# EAGLE design Laser785Adapter (EAGLE 8.0.2)
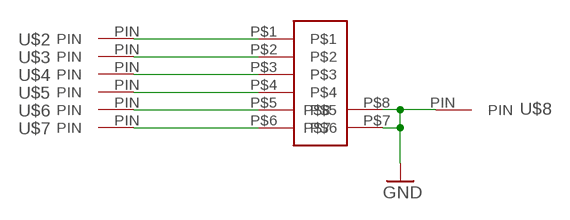
[diagram p0: schematic, sheet 1]

## Parts
U$1  MOLEX_5023860670  [MOLEX_5023860670]
U$2  PIN  [PIN]
U$3  PIN  [PIN]
U$4  PIN  [PIN]
U$5  PIN  [PIN]
U$6  PIN  [PIN]
U$7  PIN  [PIN]
U$8  PIN  [PIN]

## Nets
GND: U$1.P$7 U$1.P$8 U$8.PIN
N$1: U$1.P$1 U$2.PIN
N$2: U$1.P$2 U$3.PIN
N$3: U$1.P$3 U$4.PIN
N$4: U$1.P$4 U$5.PIN
N$5: U$1.P$5 U$6.PIN
N$6: U$1.P$6 U$7.PIN

## Library data of the parts
U$1 = My_MolexConn:MOLEX_5023860670
U$2-U$8 = MySTM32F103RGT6:PIN

## Board
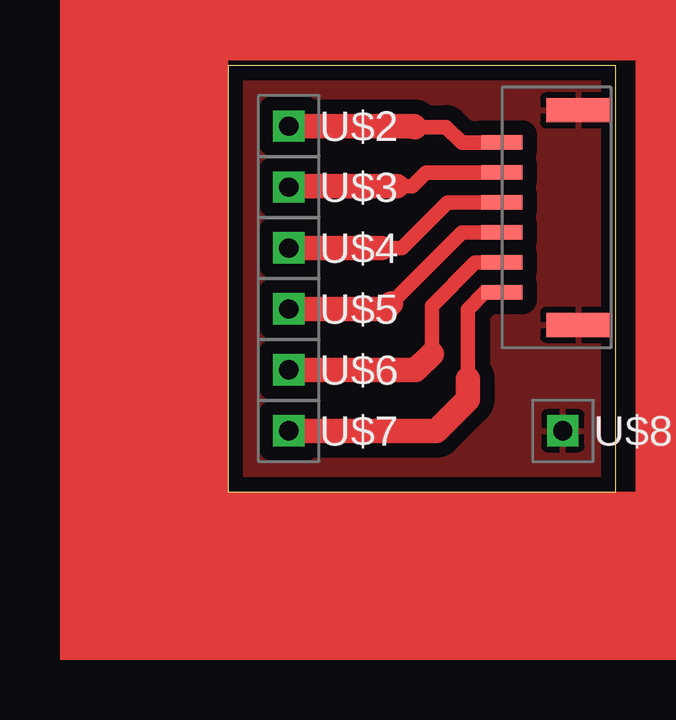
[diagram p1: board, top side]

Size 16.18 x 17.77 mm. Coordinates in mm from the lower left corner, seen from the top.
Outline: 0,0 16.18,0 16.18,17.77 0,17.77 0,0
Copper layers (1*16): Top 0.035mm / dielectric 1.5mm / Bottom 0.035mm
Design rules "default *": minimum track width 10mil, minimum drill 24mil, track to track 8mil, track to pad 8mil, pad to pad 8mil, via to via 8mil, smd to smd 8mil, copper to edge 10mil, drill to drill 8mil, minimum pad ring 10mil, minimum via ring 8mil, stop-mask expansion 4mil, vias tented up to drill 0mil, thermal gap 10mil

### Footprints (pad centres in the part's own frame; a part is rotated, then mirrored left to right if it is on the bottom)
MOLEX_5023860670 = smd 0.6 x 1.7: P$1 -3.125,0; P$2 -1.875,0; P$3 -0.625,0; P$4 0.625,0; P$5 1.875,0; P$6 3.125,0 | smd 1 x 2.7: P$7 -4.475,3.2; P$8 4.475,3.2
PIN = drill 0.8 square: PIN 0,0

### Placement (x,y rotation side)
U$1  11.43,11.43 270 top
U$2  2.54,15.24 0 top
U$3  2.54,12.7 0 top
U$4  2.54,10.16 0 top
U$5  2.54,7.62 0 top
U$6  2.54,5.08 0 top
U$7  2.54,2.54 0 top
U$8  13.97,2.54 0 top

### Tracks (layer width: path | path; a pad name or v marks a point on that pad's centre or on a via)
GND
  pour Top (isolate 0.61): 0,0 16.2,0 16.2,17.75 0,17.75
N$1
  Top 0.61: 7.8,15.2 9.1,15.2 9.75,14.55 U$1.P$1
  Top 1.016: U$2.PIN 7.76,15.24 7.8,15.2
N$2
  Top 0.61: U$1.P$2 8.26,13.3 7.7,12.75 7.05,12.75
  Top 1.016: 7.05,12.75 2.59,12.75 U$3.PIN
N$3
  Top 0.61: U$1.P$3 9.15,12.05 7.25,10.15 6.4,10.15
  Top 1.016: 6.4,10.15 U$4.PIN
N$4
  Top 0.61: U$1.P$4 9.76,10.8 6.8,7.85
  Top 1.016: U$5.PIN 6.57,7.62 6.8,7.85
N$5
  Top 0.61: U$1.P$5 10.3,9.55 8.5,7.75 8.5,5.75
  Top 1.016: U$6.PIN 7.83,5.08 8.5,5.75
N$6
  Top 0.61: U$1.P$6 10.71,8.3 10,7.6 10,4.7
  Top 1.016: U$7.PIN 8.69,2.54 10,3.85 10,4.7
(copper drawn outside any net)
  shapes: Top area x5